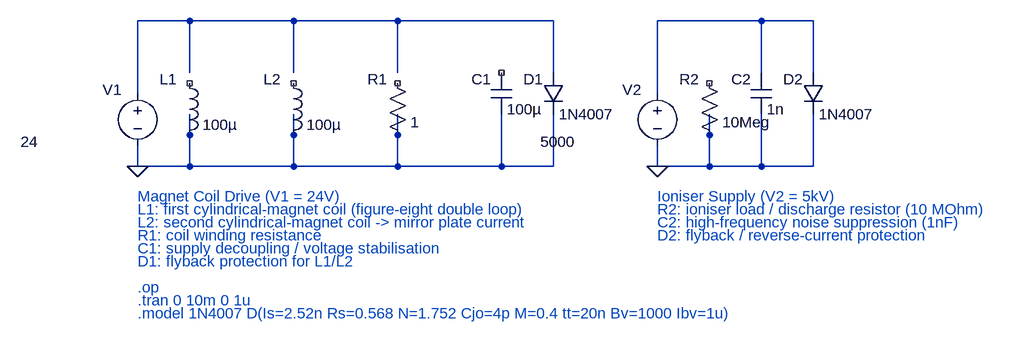
[diagram p0: schematic circuit.asc]
circuit.asc, the LTspice schematic file:
Version 4
SHEET 1 1200 800
WIRE 80 80 0 80
WIRE 240 80 80 80
WIRE 400 80 240 80
WIRE 560 80 400 80
WIRE 640 80 560 80
WIRE 640 80 640 160
WIRE 80 80 80 160
WIRE 240 80 240 160
WIRE 400 80 400 160
WIRE 0 80 0 192
WIRE 80 240 80 224
WIRE 240 240 240 224
WIRE 400 240 400 224
WIRE 560 240 560 224
WIRE 640 240 640 224
WIRE 0 304 0 272
WIRE 80 304 80 240
WIRE 80 304 0 304
WIRE 240 304 240 240
WIRE 240 304 80 304
WIRE 400 304 400 240
WIRE 400 304 240 304
WIRE 560 304 560 240
WIRE 560 304 400 304
WIRE 640 304 640 240
WIRE 640 304 560 304
WIRE 880 80 800 80
WIRE 960 80 880 80
WIRE 960 80 960 160
WIRE 1040 80 960 80
WIRE 1040 80 1040 160
WIRE 800 80 800 192
WIRE 880 240 880 224
WIRE 960 240 960 224
WIRE 1040 240 1040 224
WIRE 800 304 800 272
WIRE 880 304 880 240
WIRE 880 304 800 304
WIRE 960 304 960 240
WIRE 960 304 880 304
WIRE 1040 304 1040 240
WIRE 1040 304 960 304
FLAG 0 304 0
FLAG 800 304 0
IOPIN 0 304 BiDir
IOPIN 800 304 BiDir
SYMBOL voltage 0 176 R0
WINDOW 0 -54 10 Left 2
WINDOW 3 -180 90 Left 2
SYMATTR InstName V1
SYMATTR Value 24
SYMBOL voltage 800 176 R0
WINDOW 0 -54 10 Left 2
WINDOW 3 -180 90 Left 2
SYMATTR InstName V2
SYMATTR Value 5000
SYMBOL ind 64 160 R0
WINDOW 0 -30 10 Left 2
SYMATTR InstName L1
SYMATTR Value 100µ
SYMBOL ind 224 160 R0
WINDOW 0 -30 10 Left 2
SYMATTR InstName L2
SYMATTR Value 100µ
SYMBOL res 384 160 R0
WINDOW 0 -30 10 Left 2
SYMATTR InstName R1
SYMATTR Value 1
SYMBOL cap 544 160 R0
WINDOW 0 -30 10 Left 2
SYMATTR InstName C1
SYMATTR Value 100µ
SYMBOL diode 624 160 R0
WINDOW 0 -30 10 Left 2
SYMATTR InstName D1
SYMATTR Value 1N4007
SYMBOL res 864 160 R0
WINDOW 0 -30 10 Left 2
SYMATTR InstName R2
SYMATTR Value 10Meg
SYMBOL cap 944 160 R0
WINDOW 0 -30 10 Left 2
SYMATTR InstName C2
SYMATTR Value 1n
SYMBOL diode 1024 160 R0
WINDOW 0 -30 10 Left 2
SYMATTR InstName D2
SYMATTR Value 1N4007
TEXT 0 350 Left 2 ;Magnet Coil Drive (V1 = 24V)
TEXT 0 370 Left 2 ;L1: first cylindrical-magnet coil (figure-eight double loop)
TEXT 0 390 Left 2 ;L2: second cylindrical-magnet coil -> mirror plate current
TEXT 0 410 Left 2 ;R1: coil winding resistance
TEXT 0 430 Left 2 ;C1: supply decoupling / voltage stabilisation
TEXT 0 450 Left 2 ;D1: flyback protection for L1/L2
TEXT 800 350 Left 2 ;Ioniser Supply (V2 = 5kV)
TEXT 800 370 Left 2 ;R2: ioniser load / discharge resistor (10 MOhm)
TEXT 800 390 Left 2 ;C2: high-frequency noise suppression (1nF)
TEXT 800 410 Left 2 ;D2: flyback / reverse-current protection
TEXT 0 490 Left 2 .op
TEXT 0 510 Left 2 .tran 0 10m 0 1u
TEXT 0 530 Left 2 .model 1N4007 D(Is=2.52n Rs=0.568 N=1.752 Cjo=4p M=0.4 tt=20n Bv=1000 Ibv=1u)

The netlist it stands for:
* circuit.asc
V1 N001 0 24
V2 N002 0 5000
L1 NC_01 0 100µ
L2 NC_02 0 100µ
R1 NC_03 0 1
C1 NC_04 0 100µ
D1 N001 0 1N4007
R2 NC_05 0 10Meg
C2 N002 0 1n
D2 N002 0 1N4007
.model D D
.lib standard.dio
* Magnet Coil Drive (V1 = 24V)
* L1: first cylindrical-magnet coil (figure-eight double loop)
* L2: second cylindrical-magnet coil -> mirror plate current
* R1: coil winding resistance
* C1: supply decoupling / voltage stabilisation
* D1: flyback protection for L1/L2
* Ioniser Supply (V2 = 5kV)
* R2: ioniser load / discharge resistor (10 MOhm)
* C2: high-frequency noise suppression (1nF)
* D2: flyback / reverse-current protection
* .op
* .tran 0 10m 0 1u
* .model 1N4007 D(Is=2.52n Rs=0.568 N=1.752 Cjo=4p M=0.4 tt=20n Bv=1000 Ibv=1u)
.backanno
.end